# EAGLE schematic vFx-Teensy4.0 (EAGLE 9.6.2)
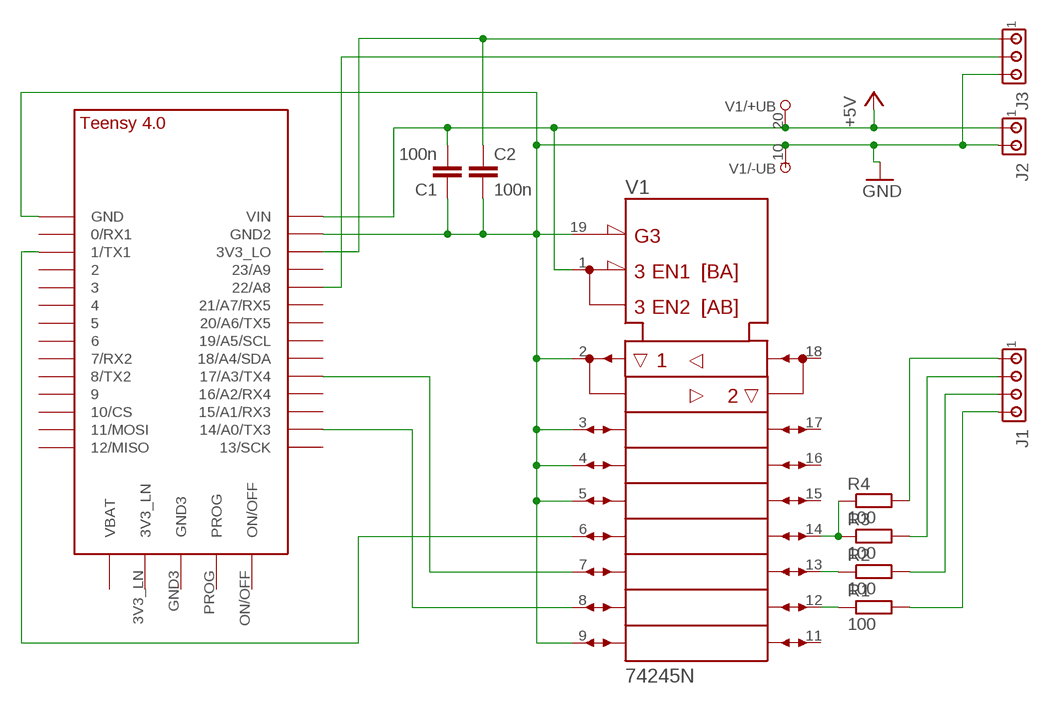
[diagram p0: schematic, sheet 1]

## Parts
C1  100n  C-EU050-025X075  [C050-025X075]
C2  100n  C-EU050-025X075  [C050-025X075]
J1  MTA04-100  [10X04MTA]
J2  MTA02-100  [10X02MTA]
J3  MTA03-100  [10X03MTA]
R1  100  R-EU_0207/10  [0207/10]
R2  100  R-EU_0207/10  [0207/10]
R3  100  R-EU_0207/10  [0207/10]
R4  100  R-EU_0207/10  [0207/10]
U$1  TEENSY_4.0-BASIC  [TEENSY_4.0-BASIC]
V1  74245N  [DIL20]

## Nets
+5V: C1.2 J2.1 U$1.VIN V1.1(DIR) V1.20(+UB)
GND: C1.1 C2.2 J2.2 J3.3 U$1.GND U$1.GND2 V1.2(A1) V1.3(A2) V1.4(A3) V1.5(A4) V1.9(A8) V1.10(-UB) V1.19(!G)
N$1: J3.2 U$1.22/A8
N$2: C2.1 J3.1 U$1.3V3_LO
N$5: J1.1 R4.2
N$7: J1.2 R3.2
N$8: J1.3 R2.2
N$9: J1.4 R1.2
N$10: U$1.14/A0(14/A0/TX3) V1.8(A7)
N$11: R1.1 V1.12(B7)
N$12: R2.1 V1.13(B6)
N$13: R3.1 R4.1 V1.14(B5)
N$14: U$1.17/A3(17/A3/TX4) V1.7(A6)
N$21: U$1.1/TX(1/TX1) V1.6(A5)
Unconnected: U$1.0/RX(0/RX1) U$1.2 U$1.3/CANTX U$1.3V3_LN U$1.4/CANRX U$1.5 U$1.6 U$1.7(7/RX2) U$1.8(8/TX2) U$1.9/CS U$1.10/CS U$1.11/MOSI U$1.12/MISO U$1.13/SCK U$1.15/A1(15/A1/RX3) U$1.16/A2(16/A2/RX4) U$1.18/A4/SDA U$1.19/A5/SCL U$1.20/A6(20/A6/TX5) U$1.21/A7(21/A7/RX5) U$1.23/A9 U$1.GND3 U$1.ON/OFF U$1.PROG U$1.VBAT\(VBAT) V1.11(B8) V1.15(B4) V1.16(B3) V1.17(B2) V1.18(B1)

## Library data of the parts
C1 C2 = rcl:C-EU: CAPACITOR, European symbol; SPICEPREFIX: C
J1 = con-amp:MTA04-100: AMP connector
J2 = con-amp:MTA02-100: AMP connector
J3 = con-amp:MTA03-100: AMP connector
R1-R4 = rcl:R-EU_: RESISTOR, European symbol; SPICEPREFIX: R
U$1 = Teensy-4.0:TEENSY_4.0-BASIC
V1 = 74ttl-din:74*245: Octal BUS TRANSCEIVER, 3-state